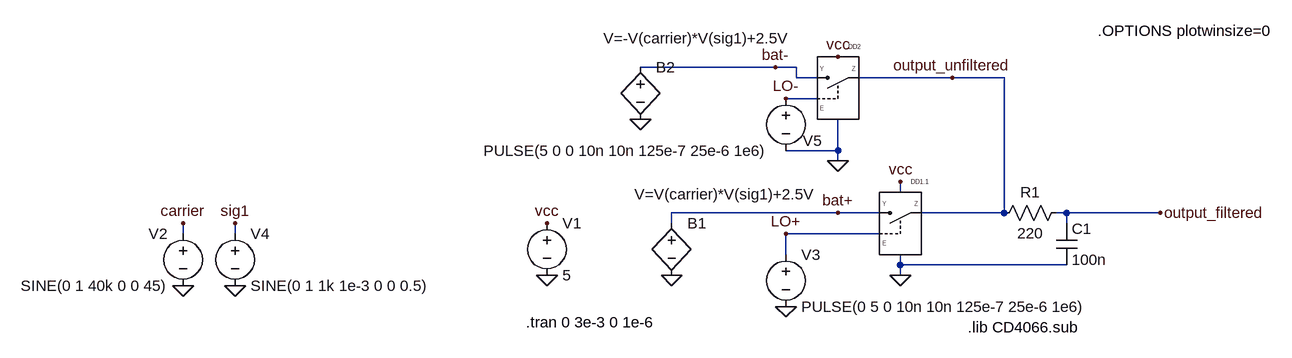
[diagram p0: schematic 4066_mixer.asc]
4066_mixer.asc, the LTspice schematic file:
Version 4
SHEET 1 1176 680
WIRE 192 -64 -16 -64
WIRE 224 -64 192 -64
WIRE 224 -48 224 -64
WIRE 256 -48 224 -48
WIRE 464 -48 320 -48
WIRE 544 -48 464 -48
WIRE 256 -16 208 -16
WIRE 288 64 288 16
WIRE 288 64 208 64
WIRE 288 80 288 64
WIRE 384 128 384 112
WIRE 288 160 32 160
WIRE 352 160 288 160
WIRE 544 160 544 -48
WIRE 544 160 416 160
WIRE 640 160 624 160
WIRE 784 160 640 160
WIRE 32 176 32 160
WIRE 640 176 640 160
WIRE -720 192 -720 176
WIRE -640 192 -640 176
WIRE 352 192 208 192
WIRE 208 224 208 192
WIRE 384 240 384 224
WIRE 640 240 384 240
WIRE 384 256 384 240
FLAG 384 256 0
FLAG 384 112 vcc
FLAG 32 256 0
FLAG -160 256 0
FLAG -160 176 vcc
FLAG 208 304 0
FLAG -720 176 carrier
FLAG -640 176 sig1
FLAG -720 272 0
FLAG -640 272 0
FLAG 288 160 bat+
FLAG 208 192 LO+
FLAG 288 -80 vcc
FLAG 288 80 0
FLAG 208 -16 LO-
FLAG -16 16 0
FLAG 192 -64 bat-
FLAG 464 -48 output_unfiltered
FLAG 784 160 output_filtered
SYMBOL voltage -160 160 R0
SYMATTR InstName V1
SYMATTR Value 5
SYMBOL voltage -720 176 M0
WINDOW 123 0 0 Left 0
WINDOW 39 0 0 Left 0
SYMATTR InstName V2
SYMATTR Value SINE(0 1 40k 0 0 45)
SYMBOL voltage 208 208 R0
WINDOW 123 0 0 Left 0
WINDOW 39 0 0 Left 0
SYMATTR InstName V3
SYMATTR Value PULSE(0 5 0 10n 10n 125e-7 25e-6 1e6)
SYMBOL Switches\\CD4066 384 176 R0
WINDOW 38 0 0 Invisible 0
SYMATTR SpiceModel CD4066
SYMATTR InstName DD1.1
SYMBOL voltage -640 176 R0
WINDOW 123 0 0 Left 0
WINDOW 39 0 0 Left 0
SYMATTR InstName V4
SYMATTR Value SINE(0 1 1k 1e-3 0 0 0.5)
SYMBOL bv 32 160 R0
WINDOW 3 -57 -29 Left 2
SYMATTR Value V=V(carrier)*V(sig1)+2.5V
SYMATTR InstName B1
SYMBOL Switches\\CD4066 288 -32 R0
WINDOW 38 0 0 Invisible 0
SYMATTR SpiceModel CD4066
SYMATTR InstName DD2
SYMBOL voltage 208 -32 M0
WINDOW 123 0 0 Left 0
WINDOW 39 0 0 Left 0
WINDOW 0 -55 81 Left 2
SYMATTR InstName V5
SYMATTR Value PULSE(5 0 0 10n 10n 125e-7 25e-6 1e6)
SYMBOL bv -16 -80 R0
WINDOW 3 -57 -29 Left 2
SYMATTR Value V=-V(carrier)*V(sig1)+2.5V
SYMATTR InstName B2
SYMBOL res 640 144 R90
WINDOW 0 0 56 VBottom 2
WINDOW 3 32 56 VTop 2
SYMATTR InstName R1
SYMATTR Value 220
SYMBOL cap 624 176 R0
SYMATTR InstName C1
SYMATTR Value 100n
TEXT -192 328 Left 2 !.tran 0 3e-3 0 1e-6
TEXT 488 336 Left 2 !.lib CD4066.sub
TEXT 688 -120 Left 2 !.OPTIONS plotwinsize=0

The netlist it stands for:
* 4066_mixer.asc
V1 vcc 0 5
V2 carrier 0 SINE(0 1 40k 0 0 45)
V3 LO+ 0 PULSE(0 5 0 10n 10n 125e-7 25e-6 1e6)
XDD1.1 LO+ bat+ output_unfiltered vcc 0 CD4066  ; pins EN Y OUT VCC VSS
V4 sig1 0 SINE(0 1 1k 1e-3 0 0 0.5)
B1 bat+ 0 V=V(carrier)*V(sig1)+2.5V
XDD2 LO- bat- output_unfiltered vcc 0 CD4066  ; pins EN Y OUT VCC VSS
V5 LO- 0 PULSE(5 0 0 10n 10n 125e-7 25e-6 1e6)
B2 bat- 0 V=-V(carrier)*V(sig1)+2.5V
R1 output_filtered output_unfiltered 220
C1 output_filtered 0 100n
.tran 0 3e-3 0 1e-6
.lib CD4066.sub
.OPTIONS plotwinsize=0
.lib CD4066.sub
.backanno
.end